# EAGLE design JugendNetzteil (EAGLE 8.5.0)
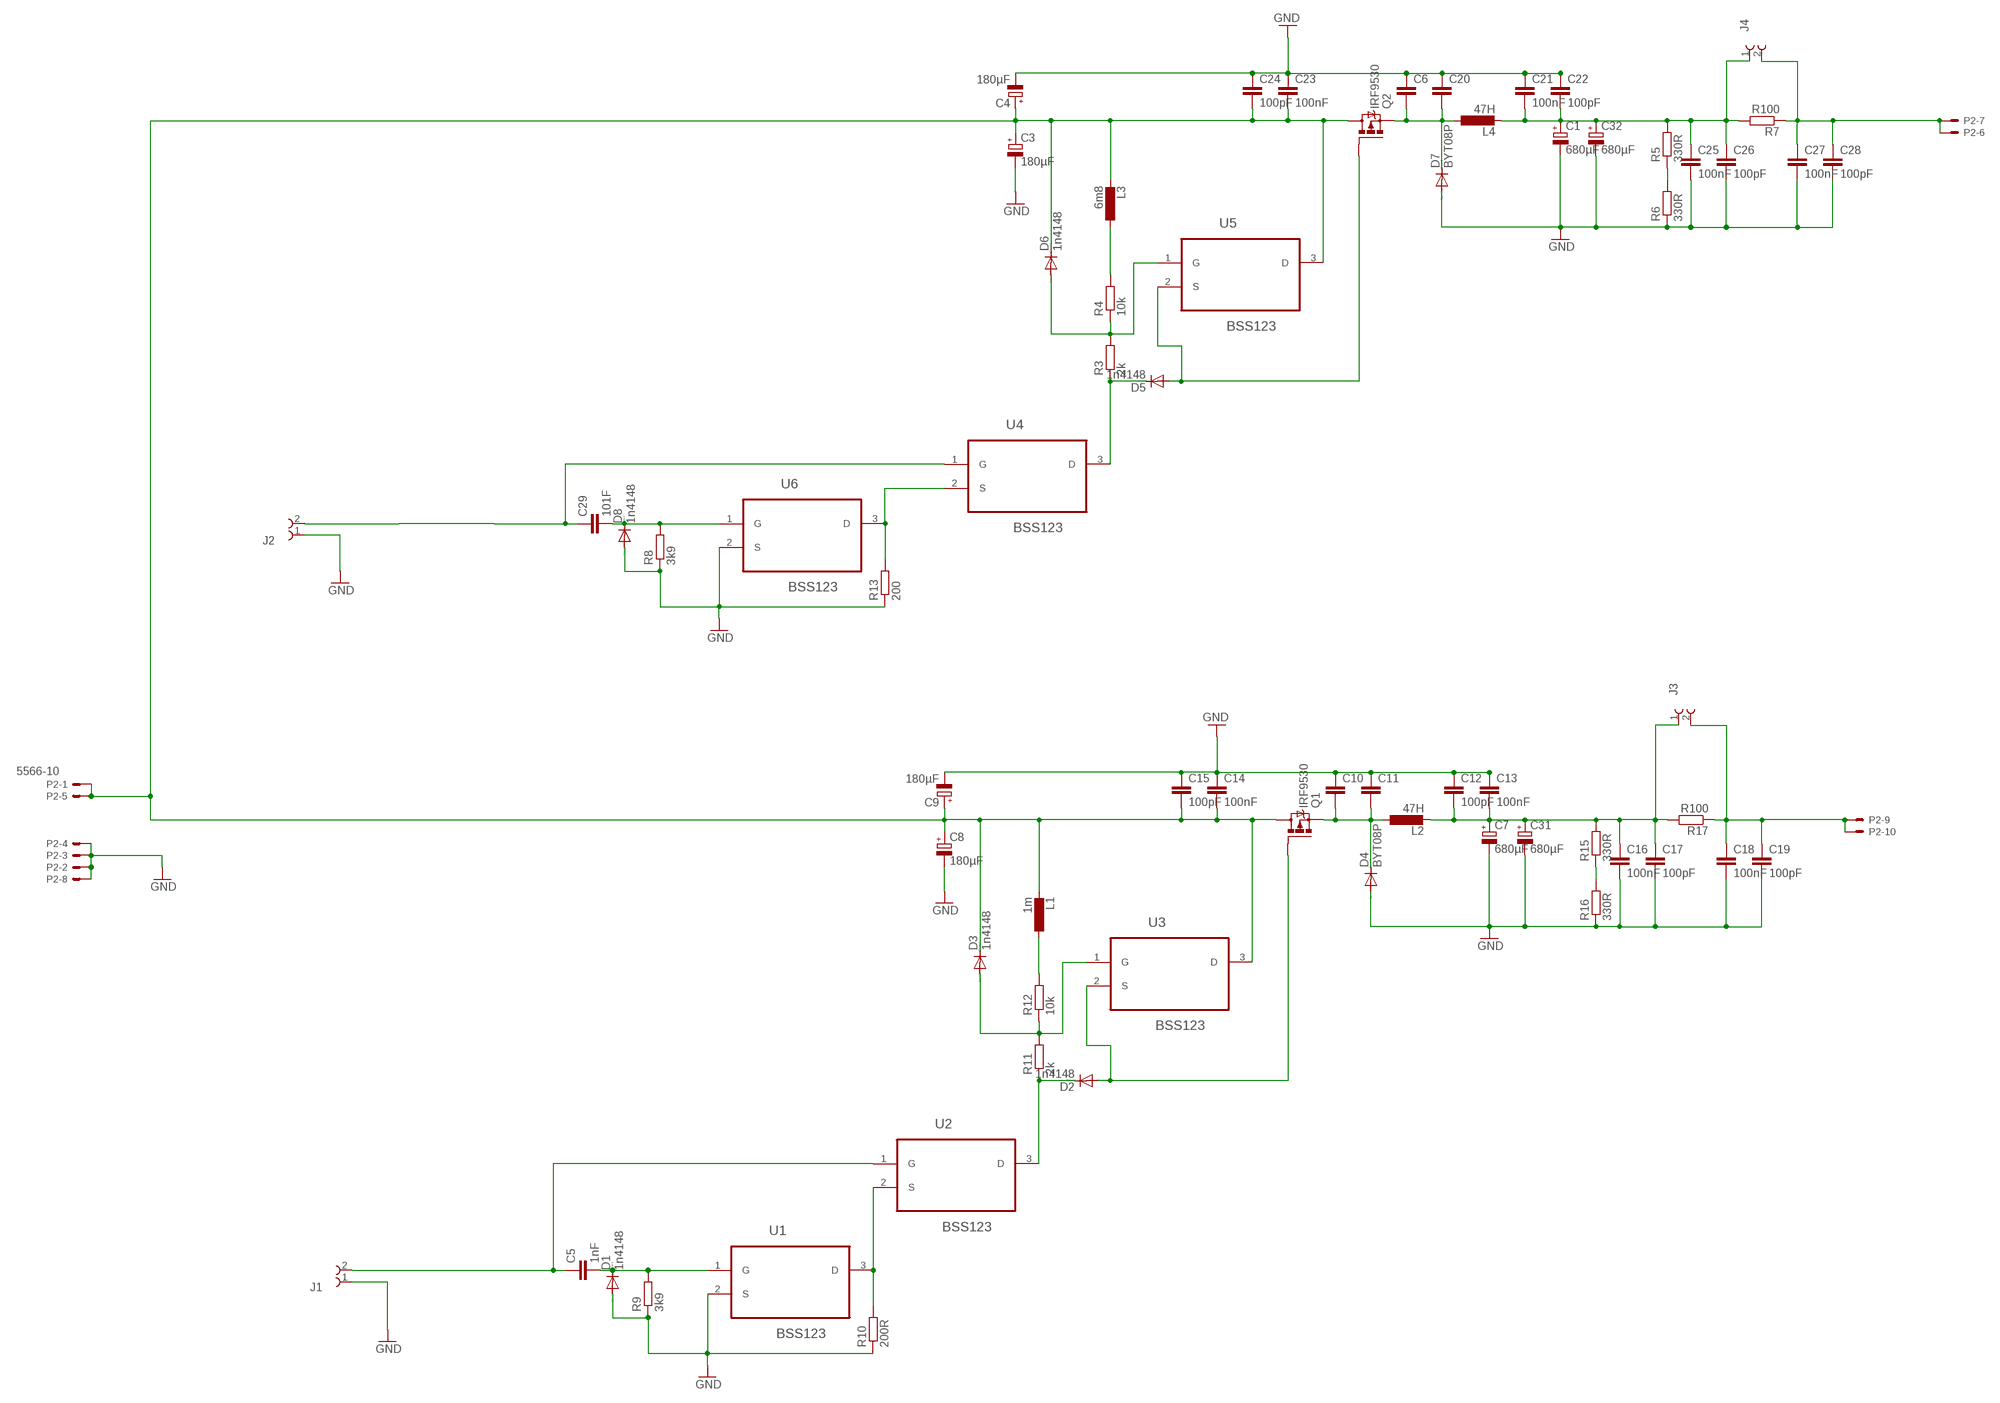
[diagram p0: schematic, sheet 1]

## Parts
C1  680µF  CPOL-EUTT5D11  [TT5D11]
C3  180µF  CPOL-EUE5-8.5  [E5-8,5]
C4  180µF  CPOL-EUE5-8.5  [E5-8,5]
C5  1nF  C-EUC0805  [C0805]
C6  C-EUC1206  [C1206]
C7  680µF  CPOL-EUTT5D11  [TT5D11]
C8  180µF  CPOL-EUE5-8.5  [E5-8,5]
C9  180µF  CPOL-EUE5-8.5  [E5-8,5]
C10  C-EUC1206  [C1206]
C11  C-EUC1206  [C1206]
C12  100pF  C-EUC1206  [C1206]
C13  100nF  C-EUC1206  [C1206]
C14  100nF  C-EUC1206  [C1206]
C15  100pF  C-EUC1206  [C1206]
C16  100nF  C-EUC1206  [C1206]
C17  100pF  C-EUC1206  [C1206]
C18  100nF  C-EUC1206  [C1206]
C19  100pF  C-EUC1206  [C1206]
C20  C-EUC1206  [C1206]
C21  100nF  C-EUC1206  [C1206]
C22  100pF  C-EUC1206  [C1206]
C23  100nF  C-EUC1206  [C1206]
C24  100pF  C-EUC1206  [C1206]
C25  100nF  C-EUC1206  [C1206]
C26  100pF  C-EUC1206  [C1206]
C27  100nF  C-EUC1206  [C1206]
C28  100pF  C-EUC1206  [C1206]
C29  101F  C-EUC0805  [C0805]
C31  680µF  CPOL-EUTT5D11  [TT5D11]
C32  680µF  CPOL-EUTT5D11  [TT5D11]
D1  1n4148  DIODE-MINIMELF  [MINIMELF]
D2  1n4148  DIODE-MINIMELF  [MINIMELF]
D3  1n4148  DIODE-MINIMELF  [MINIMELF]
D4  BYT08P  [TO220ACS]
D5  1n4148  DIODE-MINIMELF  [MINIMELF]
D6  1n4148  DIODE-MINIMELF  [MINIMELF]
D7  BYT08P  [TO220ACS]
D8  1n4148  DIODE-MINIMELF  [MINIMELF]
J1  691210910002  [691210910002]
J2  691210910002  [691210910002]
J3  691210910002  [691210910002]
J4  691210910002  [691210910002]
L1  1m  L-EU0207/15  [0207/15]
L2  47H  L-EUTJ8-U1  [TJ8-U1]
L3  6m8  L-EU0207/15  [0207/15]
L4  47H  L-EUTJ8-U1  [TJ8-U1]
P2  5566-10  [5566-10]
Q1  IRF9530  [TO220BV]
Q2  IRF9530  [TO220BV]
R3  2k  R-EU_R0805  [R0805]
R4  10k  R-EU_R0805  [R0805]
R5  330R  R-EU_0817/7V  [P0817V]
R6  330R  R-EU_0817/7V  [P0817V]
R7  R100  R-EU_0817/7V  [P0817V]
R8  3k9  R-EU_R0805  [R0805]
R9  3k9  R-EU_R0805  [R0805]
R10  200R  R-EU_R0805  [R0805]
R11  2k  R-EU_R0805  [R0805]
R12  10k  R-EU_R0805  [R0805]
R13  200  R-EU_R0805  [R0805]
R15  330R  R-EU_0817/7V  [P0817V]
R16  330R  R-EU_0817/7V  [P0817V]
R17  R100  R-EU_0817/7V  [P0817V]
U1  BSS123  TSM2314CX  [SOT95P280X130-3N]
U2  BSS123  TSM2314CX  [SOT95P280X130-3N]
U3  BSS123  TSM2314CX  [SOT95P280X130-3N]
U4  BSS123  TSM2314CX  [SOT95P280X130-3N]
U5  BSS123  TSM2314CX  [SOT95P280X130-3N]
U6  BSS123  TSM2314CX  [SOT95P280X130-3N]

## Nets
+48V: C3.+ C4.+ C8.+ C9.+ C14.2 C15.2 C23.2 C24.2 D3.C D6.C L1.2 L3.2 P2.1 P2.5 Q1.D Q2.D U3.3(D) U5.3(D)
GND: C1.- C3.- C4.- C6.1 C7.- C8.- C9.- C10.1 C11.1 C12.1 C13.1 C14.1 C15.1 C16.2 C17.2 C18.2 C19.2 C20.1 C21.1 C22.1 C23.1 C24.1 C25.2 C26.2 C27.2 C28.2 C31.- C32.- D1.A D4.A D7.A D8.A J1.1 J2.1 P2.2 P2.3 P2.4 P2.8 R6.1 R8.1 R9.1 R10.1 R13.1 R16.1 U1.2(S) U6.2(S)
N$2: C5.1 J1.2 U2.1(G)
N$4: C29.1 J2.2 U4.1(G)
N$5: D6.A R3.2 R4.1 U5.1(G)
N$6: D5.A Q2.G U5.2(S)
N$7: D3.A R11.2 R12.1 U3.1(G)
N$8: D5.C R3.1 U4.3(D)
N$10: D2.A Q1.G U3.2(S)
N$11: L3.1 R4.2
N$12: D2.C R11.1 U2.3(D)
N$13: R10.2 U1.3(D) U2.2(S)
N$14: C6.2 C20.2 D7.C L4.1 Q2.S
N$15: C1.+ C21.2 C22.2 C25.1 C26.1 C32.+ J4.1 L4.2 R5.2 R7.2
N$16: R5.1 R6.2
N$17: C5.2 D1.C R9.2 U1.1(G)
N$18: L1.1 R12.2
N$21: C10.2 C11.2 D4.C L2.1 Q1.S
N$23: C7.+ C12.2 C13.2 C16.1 C17.1 C31.+ J3.1 L2.2 R15.2 R17.2
N$24: R13.2 U4.2(S) U6.3(D)
N$25: R15.1 R16.2
N$26: C29.2 D8.C R8.2 U6.1(G)
OUT1: C18.1 C19.1 J3.2 P2.9 P2.10 R17.1
OUT2: C27.1 C28.1 J4.2 P2.6 P2.7 R7.1

## Library data of the parts
C1 C3 C4 C7-C9 C31 C32 = resistor:CPOL-EU: POLARIZED CAPACITOR, European symbol
C5 C6 C10-C29 = resistor:C-EU: CAPACITOR, European symbol
D1-D3 D5 D6 D8 = diode:DIODE-: DIODE
D4 D7 = diode:BYT08P: DIODE ultra fast
J1-J4 = WR-TBL:691210910002: WR-TBL Serie 2109 - 2.54mm Horizontal Entry Modular with Rising Cage Clamp - 0.8mm2 Wires, 2 Pins=>Code : Con_TBL_Screw_RisingClamp_2.54_691210910002 <http://katalog.we-online.de/media/images/eican/Con_TBL_Screw_RisingClamp_2.54_6912109100xx_pf2.jpg> Details see: http://katalog.we-online.de/en/em/TBL_2_54_2109_HORIZONTAL_ENTRY_69121091000X Created 2014-06-17, Karrer Zheng 2014 (C) Würth Elektronik
L1-L4 = resistor:L-EU: INDUCTOR, European symbol
P2 = con-molex:5566-10: Mini FIT connector 10 pol Source: http://www.molex.com; OC_FARNELL: unknown; OC_NEWARK: unknown
Q1 Q2 = transistor-power:IRF9530: P-CHANNEL HEXFET POWER-MOS-FET Source: http://www.irf.com/product-info/datasheets/data/irf9530.pdf
R3-R13 R15-R17 = resistor:R-EU_: RESISTOR, European symbol
U1-U6 = Taiwan_Farnell:TSM2314CX: 20V N-Channel MOSFET; MPN: TSM2314CX; OC_FARNELL: 1864589; OC_NEWARK: 27T2999; PACKAGE: SOT-23-3; SUPPLIER: TAIWAN SEMICONDUCTOR

## Board
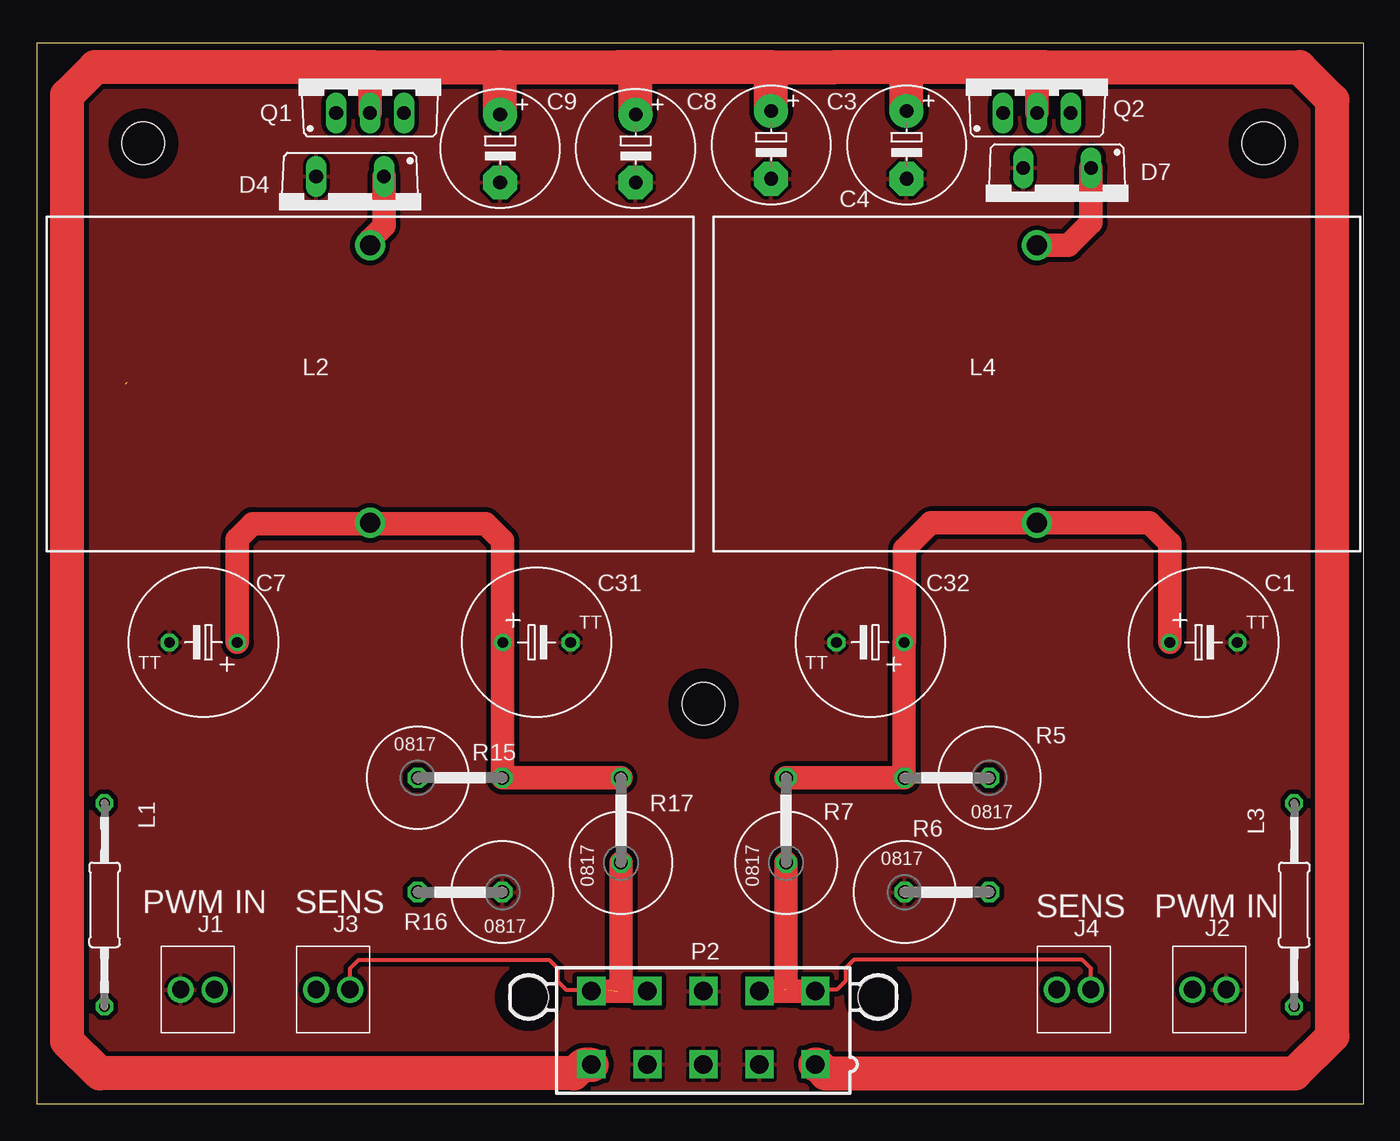
[diagram p1: board, top side]
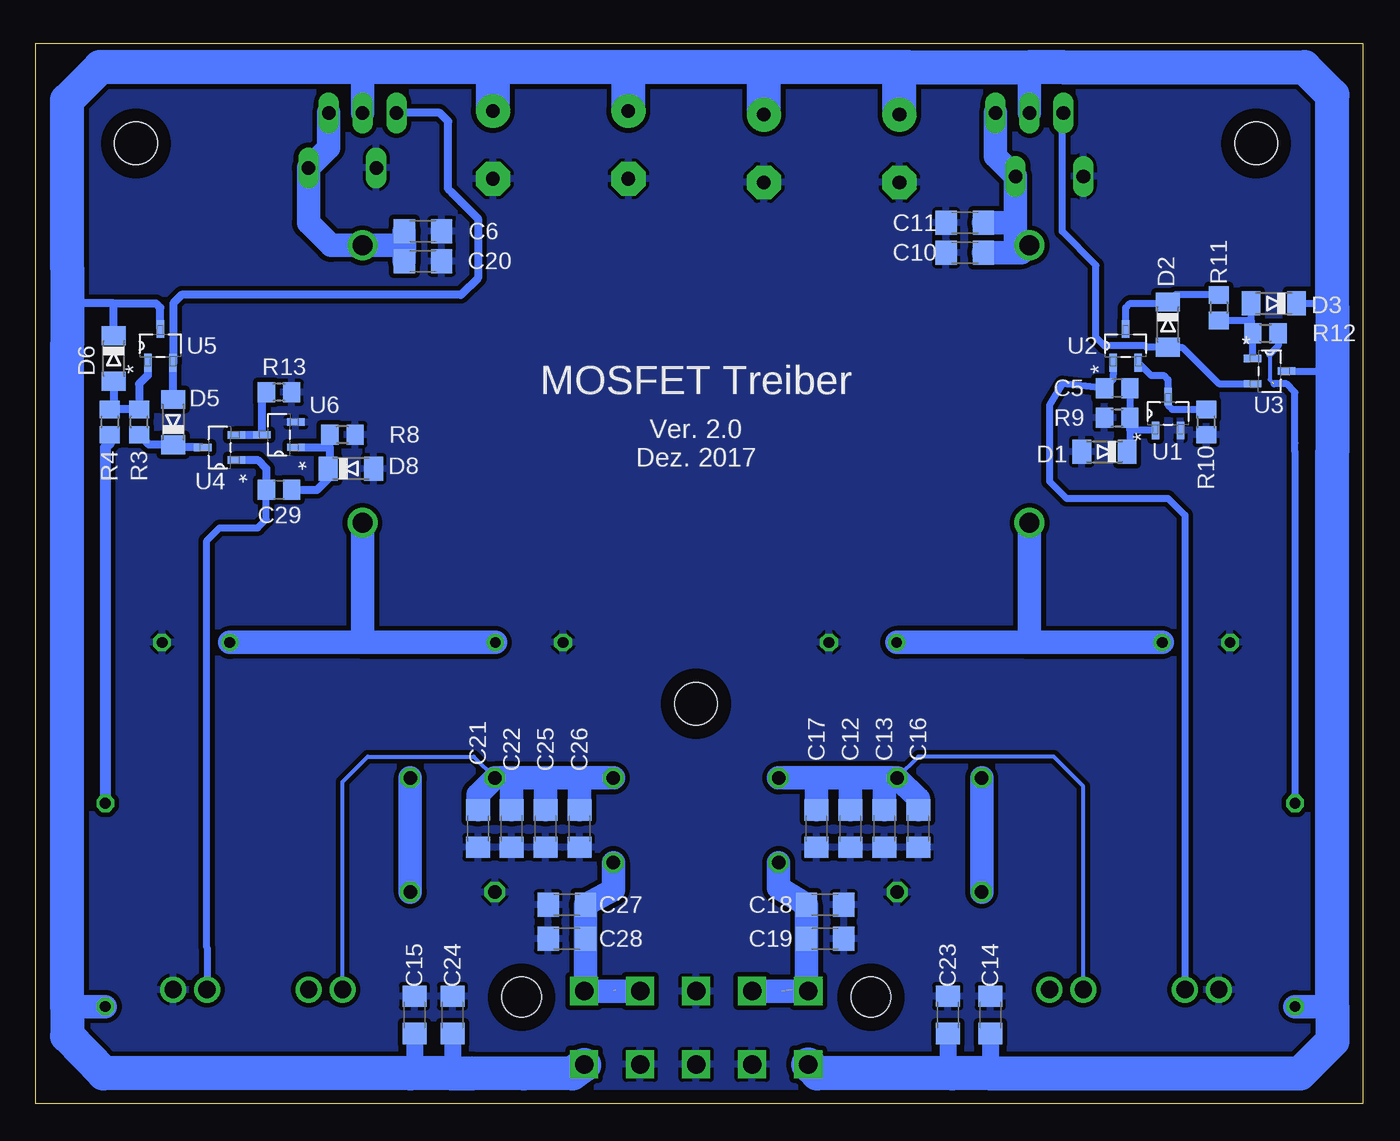
[diagram p2: board, bottom side, seen from below]

Size 99.5 x 79.5 mm. Coordinates in mm from the lower left corner, seen from the top.
Outline: 0,0 99.5,0 99.5,79.5 0,79.5 0,0
Copper layers (1*16): Top 0.035mm / dielectric 1.5mm / Bottom 0.035mm
Design rules "default *": minimum track width 12mil, minimum drill 0.35mm, track to track 14mil, track to pad 14mil, pad to pad 14mil, via to via 14mil, smd to smd 14mil, copper to edge 40mil, drill to drill 14mil, minimum pad ring 10mil, minimum via ring 8mil, stop-mask expansion 4mil, vias tented up to drill 0mil, thermal gap 10mil
Holes 3.2 mm at 8,72 92,72 50,30

### Footprints (pad centres in the part's own frame; a part is rotated, then mirrored left to right if it is on the bottom)
TT5D11 = drill 0.813: + -2.54,0 | drill 0.813 octagon: - 2.54,0
E5-8,5 = drill 1.016 pad 2.54: + -2.54,0 | drill 1.016 pad 2.54 octagon: - 2.54,0
C0805 = smd 1.3 x 1.5: 1 -0.95,0; 2 0.95,0
C1206 = smd 1.6 x 1.8: 1 -1.4,0; 2 1.4,0
MINIMELF = smd 1.4 x 1.8: A 1.7,0; C -1.7,0
TO220ACS = drill 1.016 long: A 2.54,-2.54; C -2.54,-2.54
691210910002 = drill 1.3: 1 -1.27,0; 2 1.27,0
0207/15 = drill 0.813 octagon: 1 -7.62,0; 2 7.62,0
TJ8-U1 = drill 1.5: 1 -10.4,0; 2 10.4,0
5566-10 = drill 1.4 square: 1 8.4,-2.75; 2 4.2,-2.75; 3 0,-2.75; 4 -4.2,-2.75; 5 -8.4,-2.75; 6 8.4,2.75; 7 4.2,2.75; 8 0,2.75; 9 -4.2,2.75; 10 -8.4,2.75 | hole 3: 13.1,2.29; -13.1,2.29
TO220BV = drill 1.016 long: D 0,-2.54; G -2.54,-2.54; S 2.54,-2.54
R0805 = smd 1.3 x 1.5: 1 -0.95,0; 2 0.95,0
P0817V = drill 1.016 octagon: 1 -5.08,0; 2 1.27,0
SOT95P280X130-3N = smd 1.321 x 0.559: 1 -1.27,0.94; 2 -1.27,-0.94; 3 1.27,0

### Placement (x,y rotation side)
C1  87.5,34.59 0 top
C3  55.07,71.89 270 top
C4  65.23,71.89 270 top
C5  18.41,53.66 0 bottom
C6  70.48,65.41 180 bottom
C7  12.5,34.59 180 top
C8  44.91,71.62 270 top
C9  34.75,71.62 270 top
C10  29.84,63.82 0 bottom
C11  29.84,66.04 0 bottom
C12  38.42,20.64 90 bottom
C13  35.88,20.64 90 bottom
C14  27.94,6.67 270 bottom
C15  71.12,6.67 270 bottom
C16  33.34,20.64 270 bottom
C17  40.96,20.64 270 bottom
C18  40.32,14.92 0 bottom
C19  40.32,12.38 0 bottom
C20  70.48,63.18 180 bottom
C21  66.36,20.64 90 bottom
C22  63.82,20.64 90 bottom
C23  31.11,6.67 270 bottom
C24  68.26,6.67 270 bottom
C25  61.28,20.64 270 bottom
C26  58.74,20.64 270 bottom
C27  59.69,14.92 180 bottom
C28  59.69,12.38 180 bottom
C29  81.28,46.04 0 bottom
C31  37.49,34.59 0 top
C32  62.51,34.59 180 top
D1  19.37,48.9 180 bottom
D2  14.61,58.42 270 bottom
D3  6.67,60.01 180 bottom
D4  23.5,66.99 180 top
D5  89.22,51.12 90 bottom
D6  93.66,55.88 270 bottom
D7  76.52,67.63 180 top
D8  75.88,47.62 0 bottom
J1  12.06,8.57 0 top
J2  87.93,8.57 180 top
J3  22.23,8.57 0 top
J4  77.77,8.57 0 top
L1  5.08,14.92 270 top
L2  24.99,53.96 270 top
L3  94.3,14.92 270 top
L4  75.01,53.96 270 top
P2  49.99,5.71 0 top
Q1  24.99,76.83 0 top
Q2  75.01,76.83 0 top
R3  91.76,51.12 90 bottom
R4  93.98,51.12 270 bottom
R5  66.36,24.45 180 top
R6  70.17,15.88 0 top
R7  56.2,23.16 90 top
R8  76.52,50.16 180 bottom
R9  18.41,51.44 0 bottom
R10  11.75,51.12 90 bottom
R11  10.79,59.69 270 bottom
R12  7.3,57.78 0 bottom
R13  81.28,53.34 180 bottom
R15  33.66,24.45 0 top
R16  29.84,15.88 180 top
R17  43.81,23.16 90 top
U1  14.61,51.75 90 bottom
U2  17.78,56.83 90 bottom
U3  6.99,54.93 0 bottom
U4  85.72,49.21 180 bottom
U5  90.17,56.83 90 bottom
U6  81.28,50.16 180 bottom

### Tracks (layer width: path | path; a pad name or v marks a point on that pad's centre or on a via)
+48V
  Top 1.27: 22.86,77.55 22.7,77.71
  Top 1.778: Q1.D 24.99,77.52 25.19,77.71 | Q2.D 75.01,77.19 75.53,77.71
  Top 2.54: 41.63,2.92 41.02,2.92 40.26,2.29 4.72,2.29 2.29,4.7 2.29,75.63 4.37,77.71 22.7,77.71 25.19,77.71 34.7,77.71 | 34.7,77.71 43.62,77.71 45.11,77.71 | 55.07,77.71 45.11,77.71 | 55.07,77.71 59.93,77.71 64.52,77.71 | 64.52,77.71 75.53,77.71 94.69,77.71 97.16,75.25 97.16,5.08 94.36,2.29 59.18,2.29 58.5,2.96 P2.1 | C9.+ 34.75,77.67 34.7,77.71 | C8.+ 44.91,77.51 45.11,77.71 | C3.+ 55.07,77.71 | C4.+ 65.23,77 64.52,77.71
  Bottom 0.305: 3.04,48.26 2.29,49.01 | 2.87,50.8 2.82,52.07 2.29,51.53
  Bottom 0.508: U3.3 3.49,54.93 2.29,56.13 | D3.C 3.17,60.01 2.86,59.69 2.35,59.69 2.29,59.62
  Bottom 0.61: 97.09,59.86 97.02,56.2 | 97.09,59.86 97.16,62.73 | U5.3 90.17,59.69 90.49,60.01 93.66,60.01 | 93.66,60.01 96.94,60.01 97.09,59.86 | D6.C 93.66,60.01
  Bottom 0.813: 2.99,56.83 2.29,56.13
  Bottom 1.27: C14.2 27.94,2.31 27.92,2.29 | C23.2 31.11,2.59 30.81,2.29 | C15.2 71.12,2.58 71.42,2.29 | C24.2 68.26,2.33 68.31,2.29
  Bottom 1.778: 22.86,77.41 22.55,77.71 | Q2.D 75.01,77.67 75.06,77.71 | Q1.D 24.99,77.62 24.9,77.71 | L1.2 2.39,7.3 2.29,7.2 | L3.2 97.15,7.3 97.16,7.3
  Bottom 2.54: 58.4,2.92 59.28,2.29 62.92,2.28 66.8,2.29 68.31,2.29 71.42,2.29 94.42,2.29 97.16,5.09 97.16,7.3 97.16,56.89 97.16,62.73 97.16,75.25 94.69,77.71 75.06,77.71 65.18,77.71 | P2.5 40.91,2.29 30.81,2.29 27.92,2.29 4.7,2.29 2.29,4.7 2.29,7.2 2.29,49.01 2.29,51.53 2.29,56.13 2.29,59.62 2.29,75.63 4.37,77.71 22.55,77.71 24.9,77.71 34.14,77.71 | 55.51,77.71 65.18,77.71 | 45.17,77.71 55.51,77.71 | 34.14,77.71 45.17,77.71 | C4.+ 65.23,77.67 65.18,77.71 | C3.+ 55.07,77.27 55.51,77.71 | C8.+ 44.91,77.45 45.17,77.71 | C9.+ 34.75,77.11 34.14,77.71
GND
  pour Top: 0,0 100.01,0 100.01,80.01 0,80.01
  pour Bottom: 0,80.01 100.01,80.01 100.01,0 0,0
N$2
  Bottom 0.508: U2.1 18.72,54.66 18.73,54.66 18.73,54.3 C5.1 22.54,53.98 23.5,52.39 23.5,46.67 22.23,45.4 14.61,45.4 13.34,44.13 J1.2
N$4
  Bottom 0.508: J2.2 86.67,11.72 86.68,11.73 86.68,42.23 85.72,43.18 82.87,43.18 82.23,43.81 C29.1
  Bottom 0.61: U4.1 82.88,48.27 82.23,47.62 C29.1
N$5
  Bottom 0.61: 91.78,52.07 93.65,52.07 | 91.78,52.07 R3.2 | 93.65,52.07 R4.1 | D6.A 93.66,52.08 93.65,52.07 | U5.1 91.11,54.62 91.76,53.98 91.76,52.09 91.78,52.07
N$6
  Bottom 0.61: Q2.G 69.22,74.3 68.58,73.66 68.58,68.58 68.26,68.26 67.63,67.63 66.36,66.36 66.36,61.91 67.63,60.64 88.58,60.64 89.2,60.02 89.2,55.59 U5.2 D5.A
N$7
  Bottom 0.508: 10.81,58.73 R11.2 8.38,58.74 8.37,58.75 | U3.1 R12.1 8.37,57.9 8.37,58.75 | 8.37,58.75 D3.A
N$8
  Bottom 0.61: U4.3 89.01,49.21 D5.C 91.01,49.42 R3.1
N$10
  Bottom 0.508: Q1.G 22.54,74.21 22.54,72.07 22.54,71.75 22.54,66.67 22.54,65.41 20,62.87 20,57.47 19.37,56.83 16.31,56.83 16.2,56.72 D2.A | 14.49,56.83 D2.A | U3.2 10.81,53.99 13.54,56.72 D2.A
N$11
  Bottom 0.813: R4.2 93.98,49.53 94.3,49.21 L3.1
N$12
  Bottom 0.508: R11.1 14.09,60.64 D2.C 14.72,60.01 17.46,60.01 17.78,59.69 U2.3
N$13
  Bottom 0.508: R10.2 14.29,52.07 14.61,52.39 U1.3 14.61,54.29 14.92,54.61 15.88,54.61 16.83,55.56 U2.2
N$14
  Top 1.778: D7.C 79.06,66.04 77.38,64.36 L4.1
  Bottom 1.778: C6.2 C20.2 71.86,64.48 71.97,64.36 L4.1 77.38,64.36 79.06,66.04 D7.C 77.55,71.68 Q2.S
N$15
  Top 1.778: 65.08,24.43 R7.2 | 65.08,24.43 R5.2 | C1.+ 84.96,42.04 83.44,43.56 L4.2 67.06,43.56 65.09,41.59 65.09,34.63 C32.+ 65.05,24.78 65.08,24.43
  Bottom 0.305: J4.1 76.5,24.14 74.61,26.04 66.67,26.04 R5.2
  Bottom 1.778: 58.98,24.43 R7.2 | 61.08,24.43 58.98,24.43 | 63.65,24.43 61.08,24.43 | 63.65,24.43 65.08,24.43 R5.2 66.36,23.18 C21.2 | C26.1 58.74,24.19 58.98,24.43 | C25.1 61.28,24.23 61.08,24.43 | C22.2 63.82,24.27 63.65,24.43 | 74.97,34.59 C32.+ | 74.97,34.59 C1.+ | L4.2 75.01,34.63 74.97,34.59
N$16
  Bottom 1.778: R6.2 R5.1
N$17
  Bottom 0.508: C5.2 R9.2 17.46,50.45 | 17.46,50.45 17.46,49.1 D1.C | U1.1 17.43,50.48 17.46,50.45
N$18  (1 unrouted)
  Bottom 0.305: 6.99,56.2 6.99,54.29 6.78,54.08
  Bottom 0.508: L1.1 5.08,48.9 5.08,49.53 5.08,53.34 5.71,53.98 6.67,53.98 | R12.2 6.35,56.83 6.99,56.2
N$21
  Top 1.778: D4.C 26.04,65.84 24.99,64.8 L2.1
  Bottom 1.778: 26.04,65.82 D4.C 27.53,71.03 Q1.S | 26.04,65.82 26.04,64.25 L2.1 25.6,63.82 C10.2 | C11.2 26.25,66.04 26.04,65.82
N$23
  Top 1.778: 34.99,24.43 R17.2 | 34.99,24.43 R15.2 | C7.+ 15.04,42.34 16.19,43.5 24.94,43.5 L2.2 25.05,43.5 33.66,43.5 34.95,42.2 C31.+ 34.95,24.47 34.99,24.43
  Bottom 0.305: J3.1 20.95,23.81 23.18,26.04 33.34,26.04 R15.2
  Bottom 1.778: 38.76,24.45 40.63,24.45 | 35.72,24.45 38.76,24.45 | 35.72,24.45 R15.2 33.34,22.86 C16.1 | 40.63,24.45 43.8,24.45 R17.2 | C17.1 40.96,24.12 40.63,24.45 | C12.2 38.42,24.1 38.76,24.45 | C13.2 35.88,24.29 35.72,24.45 | 25.17,34.59 C7.+ | 25.17,34.59 C31.+ | L2.2 24.99,34.77 25.17,34.59
N$24
  Bottom 0.61: U4.2 82.56,50.15 U6.3 82.55,53.02 R13.2
N$25
  Bottom 1.778: R16.2 R15.1
N$26
  Bottom 0.61: 77.47,49.16 77.47,47.74 | 77.47,49.16 R8.2 | 77.47,47.74 D8.C | C29.2 78.42,46.04 77.47,46.99 77.47,47.74 | U6.1 77.53,49.23 77.47,49.16
OUT1  (1 unrouted)
  Top 0.305: J3.2 23.5,10.16 24.13,10.79 25.4,10.79 38.42,10.79 39.05,10.16 39.05,9.21 39.69,8.57 42.81,8.57
  Top 1.778: 43.57,8.46 P2.9 | 43.57,8.46 P2.10 | R17.1 43.81,8.71 43.57,8.46
  Bottom 1.778: R17.1 43.81,17.46 43.81,16.19 C18.1 C19.1 41.72,8.6 P2.10 P2.9
OUT2  (1 unrouted)
  Top 0.305: J4.2 79.06,10.16 78.42,10.79 61.28,10.79 60.64,10.16 60.64,9.21 60.01,8.57 56.02,8.57
  Top 1.778: 56.27,8.46 P2.7 | 56.27,8.46 P2.6 | R7.1 56.2,8.53 56.27,8.46
  Bottom 1.778: R7.1 56.2,16.06 C27.1 C28.1 58.29,8.52 57.39,8.46 | 57.39,8.46 P2.6 | 57.39,8.46 P2.7

### Text on the board
tNames: PWM IN | SENS | SENS | PWM IN
bNames: MOSFET Treiber | Ver. 2.0 / Dez. 2017